# EAGLE board DATALOGGER_CA_ADC_V1 (EAGLE 9.5.2)
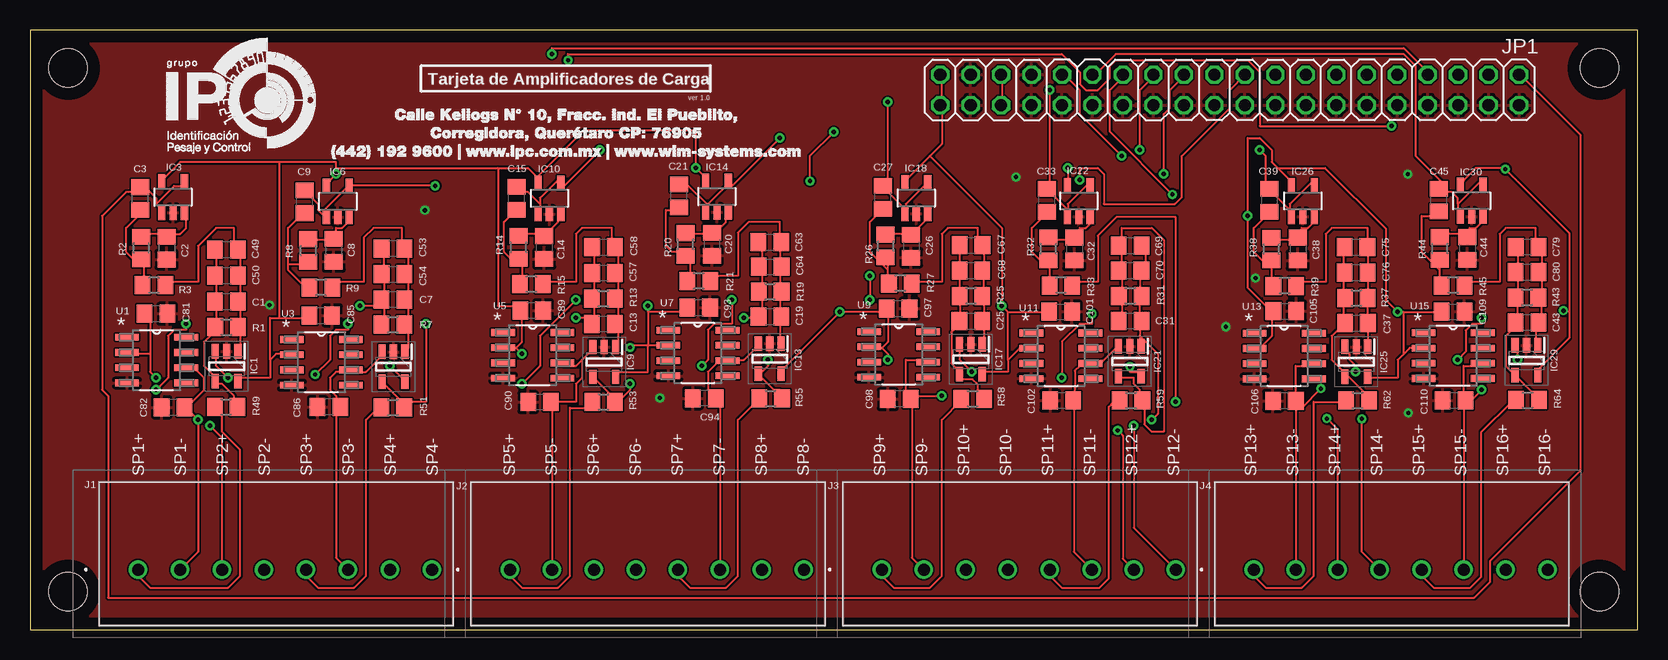
[diagram p11: board, top side]
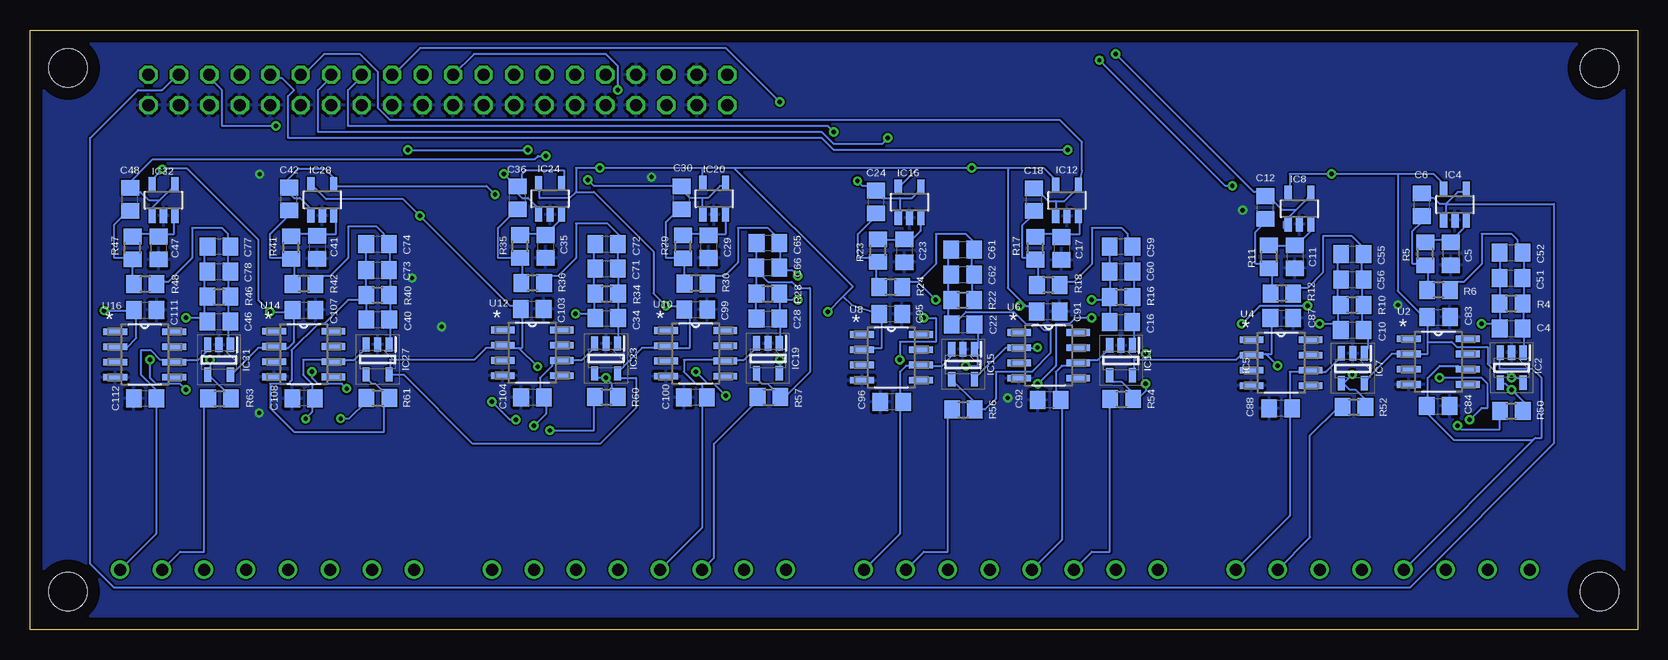
[diagram p12: board, bottom side, seen from below]

Size 134 x 50 mm. Coordinates in mm from the lower left corner, seen from the top.
Outline: 0,0 134,0 134,50 0,50 0,0
Copper layers (1*16): Top 0.035mm / dielectric 1.5mm / Bottom 0.035mm
Design rules "default": minimum track width 6mil, minimum drill 0.35mm, track to track 6mil, track to pad 6mil, pad to pad 6mil, via to via 6mil, smd to smd 6mil, copper to edge 40mil, drill to drill 6mil, minimum pad ring 10mil, minimum via ring 8mil, stop-mask expansion 4mil, vias tented up to drill 0mil, thermal gap 10mil
Holes 3.2 mm at 3.18,3.18 3.18,46.82 130.82,3.18 130.82,46.82

## Footprints (pad centres in the part's own frame; a part is rotated, then mirrored left to right if it is on the bottom)
C0805 = smd 1.3 x 1.5: 1 -0.95,0; 2 0.95,0
SOT95P280X145-5N = smd 1.2 x 0.6: 1 -1.25,0.95; 2 -1.25,0; 3 -1.25,-0.95; 4 1.25,-0.95; 5 1.25,0.95
SOT23-5 = smd 0.6 x 1.2: 1 -0.95,-1.306; 2 0,-1.306; 3 0.95,-1.306; 4 0.95,1.306; 5 -0.95,1.306
1985027 = drill 1 pad 1.5: 1 0,0; 2 3.5,0; 3 7,0; 4 10.5,0; 5 14,0; 6 17.5,0; 7 21,0; 8 24.5,0
2X20 = drill 1.016 octagon: 1 -24.13,-1.27; 2 -24.13,1.27; 3 -21.59,-1.27; 4 -21.59,1.27; 5 -19.05,-1.27; 6 -19.05,1.27; 7 -16.51,-1.27; 8 -16.51,1.27; 9 -13.97,-1.27; 10 -13.97,1.27; 11 -11.43,-1.27; 12 -11.43,1.27; 13 -8.89,-1.27; 14 -8.89,1.27; 15 -6.35,-1.27; 16 -6.35,1.27; 17 -3.81,-1.27; 18 -3.81,1.27; 19 -1.27,-1.27; 20 -1.27,1.27; 21 1.27,-1.27; 22 1.27,1.27; 23 3.81,-1.27; 24 3.81,1.27; 25 6.35,-1.27; 26 6.35,1.27; 27 8.89,-1.27; 28 8.89,1.27; 29 11.43,-1.27; 30 11.43,1.27; 31 13.97,-1.27; 32 13.97,1.27; 33 16.51,-1.27; 34 16.51,1.27; 35 19.05,-1.27; 36 19.05,1.27; 37 21.59,-1.27; 38 21.59,1.27; 39 24.13,-1.27; 40 24.13,1.27
R0805 = smd 1.3 x 1.5: 1 -0.95,0; 2 0.95,0
D8 = smd 1.981 x 0.559: 1 -2.464,1.905; 2 -2.464,0.635; 3 -2.464,-0.635; 4 -2.464,-1.905; 5 2.464,-1.905; 6 2.464,-0.635; 7 2.464,0.635; 8 2.464,1.905

## Placement (x,y rotation side)
C1  150nF  [C0805]  16.38,27.37 0 top
C2  0.018uF  [C0805]  11.39,31.8 270 top
C3  39uF  [C0805]  9.2,35.95 90 top
C4  150nF  [C0805]  10.53,25.09 0 bottom
C5  0.018uF  [C0805]  15.56,31.34 270 bottom
C6  39uF  [C0805]  17.96,35.43 90 bottom
C7  150nF  [C0805]  30.25,27.54 0 top
C8  0.018uF  [C0805]  25.32,31.62 270 top
C9  39uF  [C0805]  22.88,35.68 90 top
C10  150nF  [C0805]  23.78,24.98 0 bottom
C11  0.018uF  [C0805]  28.58,31.09 270 bottom
C12  39uF  [C0805]  31.02,35.2 90 bottom
C13  150nF  [C0805]  47.78,25.5 0 top
C14  0.018uF  [C0805]  42.86,31.87 270 top
C15  39uF  [C0805]  40.56,35.97 90 top
C16  150nF  [C0805]  43.07,25.63 0 bottom
C17  0.018uF  [C0805]  48.01,31.78 270 bottom
C18  39uF  [C0805]  50.3,35.85 90 bottom
C19  150nF  [C0805]  61.68,26.11 0 top
C20  0.018uF  [C0805]  56.84,32.13 270 top
C21  39uF  [C0805]  54.1,36.17 90 top
C22  150nF  [C0805]  56.22,25.43 0 bottom
C23  0.018uF  [C0805]  61.12,31.59 270 bottom
C24  39uF  [C0805]  63.46,35.65 90 bottom
C25  150nF  [C0805]  78.43,25.74 0 top
C26  0.018uF  [C0805]  73.46,31.96 270 top
C27  39uF  [C0805]  71.12,36.04 90 top
C28  150nF  [C0805]  72.48,25.92 0 bottom
C29  0.018uF  [C0805]  77.43,31.93 270 bottom
C30  39uF  [C0805]  79.68,36 90 bottom
C31  150nF  [C0805]  91.71,25.75 0 top
C32  0.018uF  [C0805]  87.05,31.74 270 top
C33  39uF  [C0805]  84.77,35.79 90 top
C34  150nF  [C0805]  85.93,25.96 0 bottom
C35  0.018uF  [C0805]  91.02,31.95 270 bottom
C36  39uF  [C0805]  93.36,36 90 bottom
C37  150nF  [C0805]  110.57,25.55 0 top
C38  0.018uF  [C0805]  105.68,31.74 270 top
C39  39uF  [C0805]  103.33,35.8 90 top
C40  150nF  [C0805]  105.01,25.85 0 bottom
C41  0.018uF  [C0805]  110.05,31.87 270 bottom
C42  39uF  [C0805]  112.39,35.9 90 bottom
C43  150nF  [C0805]  124.79,25.62 0 top
C44  0.018uF  [C0805]  119.8,31.78 270 top
C45  39uF  [C0805]  117.43,35.81 90 top
C46  150nF  [C0805]  118.26,25.68 0 bottom
C47  0.018uF  [C0805]  123.29,31.82 270 bottom
C48  39uF  [C0805]  125.66,35.88 90 bottom
C49  18nF  [C0805]  16.38,31.69 0 top
C50  12nF  [C0805]  16.37,29.51 0 top
C51  18nF  [C0805]  10.55,29.32 0 bottom
C52  12nF  [C0805]  10.54,31.43 0 bottom
C53  18nF  [C0805]  30.26,31.79 0 top
C54  12nF  [C0805]  30.26,29.63 0 top
C55  18nF  [C0805]  23.77,31.31 0 bottom
C56  12nF  [C0805]  23.77,29.2 0 bottom
C57  18nF  [C0805]  47.8,29.74 0 top
C58  12nF  [C0805]  47.8,31.89 0 top
C59  18nF  [C0805]  43.05,31.95 0 bottom
C60  12nF  [C0805]  43.05,29.84 0 bottom
C61  18nF  [C0805]  56.25,31.7 0 bottom
C62  12nF  [C0805]  56.25,29.59 0 bottom
C63  18nF  [C0805]  61.67,32.31 0 top
C64  12nF  [C0805]  61.7,30.25 0 top
C65  18nF  [C0805]  72.49,32.25 0 bottom
C66  12nF  [C0805]  72.5,30.19 0 bottom
C67  18nF  [C0805]  78.45,32.04 0 top
C68  12nF  [C0805]  78.44,29.93 0 top
C69  18nF  [C0805]  91.71,32.02 0 top
C70  12nF  [C0805]  91.69,29.93 0 top
C71  18nF  [C0805]  85.94,30.1 0 bottom
C72  12nF  [C0805]  85.94,32.16 0 bottom
C73  18nF  [C0805]  105.03,29.97 0 bottom
C74  12nF  [C0805]  105.03,32.14 0 bottom
C75  18nF  [C0805]  110.53,31.9 0 top
C76  12nF  [C0805]  110.54,29.77 0 top
C77  18nF  [C0805]  118.24,31.95 0 bottom
C78  12nF  [C0805]  118.25,29.84 0 bottom
C79  18nF  [C0805]  124.8,31.92 0 top
C80  12nF  [C0805]  124.79,29.81 0 top
C81  1uF  [C0805]  10.5,26.35 0 top
C82  1uF  [C0805]  11.93,18.53 180 top
C83  1uF  [C0805]  16.59,26.05 0 bottom
C84  1uF  [C0805]  16.61,18.63 0 bottom
C85  1uF  [C0805]  24.23,26.2 0 top
C86  1uF  [C0805]  24.92,18.55 180 top
C87  1uF  [C0805]  29.65,25.97 0 bottom
C88  1uF  [C0805]  29.74,18.44 180 bottom
C89  1uF  [C0805]  41.82,26.62 0 top
C90  1uF  [C0805]  42.48,18.96 180 top
C91  1uF  [C0805]  49.12,26.53 0 bottom
C92  1uF  [C0805]  49.03,19.14 180 bottom
C93  1uF  [C0805]  55.74,26.85 0 top
C94  1uF  [C0805]  56.21,19.29 180 top
C95  1uF  [C0805]  62.26,26.33 0 bottom
C96  1uF  [C0805]  62.17,18.99 180 bottom
C97  1uF  [C0805]  72.36,26.76 0 top
C98  1uF  [C0805]  72.45,19.22 180 top
C99  1uF  [C0805]  78.5,26.68 0 bottom
C100  1uF  [C0805]  78.55,19.34 180 bottom
C101  1uF  [C0805]  85.92,26.5 0 top
C102  1uF  [C0805]  85.99,19.09 180 top
C103  1uF  [C0805]  92.14,26.72 0 bottom
C104  1uF  [C0805]  92.11,19.37 180 bottom
C105  1uF  [C0805]  104.6,26.54 0 top
C106  1uF  [C0805]  104.57,19.08 180 top
C107  1uF  [C0805]  111.15,26.64 0 bottom
C108  1uF  [C0805]  111.19,19.29 180 bottom
C109  1uF  [C0805]  118.63,26.5 0 top
C110  1uF  [C0805]  118.71,19.09 180 top
C111  1uF  [C0805]  124.4,26.63 0 bottom
C112  1uF  [C0805]  124.4,19.25 180 bottom
IC1  TLV2771CDBVR  [SOT95P280X145-5N]  16.39,21.96 270 top
IC2  TLV2771CDBVR  [SOT95P280X145-5N]  10.49,21.84 270 bottom
IC3  MCP601OT  [SOT23-5]  11.93,36.06 0 top
IC4  MCP601OT  [SOT23-5]  15.21,35.44 0 bottom
IC5  TLV2771CDBVR  [SOT95P280X145-5N]  30.3,21.92 270 top
IC6  MCP601OT  [SOT23-5]  25.66,35.71 0 top
IC7  TLV2771CDBVR  [SOT95P280X145-5N]  23.73,21.78 270 bottom
IC8  MCP601OT  [SOT23-5]  28.18,35.1 0 bottom
IC9  TLV2771CDBVR  [SOT95P280X145-5N]  47.86,22.31 270 top
IC10  MCP601OT  [SOT23-5]  43.3,35.96 0 top
IC11  TLV2771CDBVR  [SOT95P280X145-5N]  43.06,22.45 270 bottom
IC12  MCP601OT  [SOT23-5]  47.56,35.78 0 bottom
IC13  TLV2771CDBVR  [SOT95P280X145-5N]  61.67,22.59 270 top
IC14  MCP601OT  [SOT23-5]  57.27,36.11 0 top
IC15  TLV2771CDBVR  [SOT95P280X145-5N]  56.22,22.11 270 bottom
IC16  MCP601OT  [SOT23-5]  60.68,35.63 0 bottom
IC17  TLV2771CDBVR  [SOT95P280X145-5N]  78.43,22.54 270 top
IC18  MCP601OT  [SOT23-5]  73.88,35.98 0 top
IC19  TLV2771CDBVR  [SOT95P280X145-5N]  72.49,22.61 270 bottom
IC20  MCP601OT  [SOT23-5]  76.97,35.93 0 bottom
IC21  TLV2771CDBVR  [SOT95P280X145-5N]  91.68,22.36 270 top
IC22  MCP601OT  [SOT23-5]  87.43,35.74 0 top
IC23  TLV2771CDBVR  [SOT95P280X145-5N]  85.98,22.61 270 bottom
IC24  MCP601OT  [SOT23-5]  90.65,35.93 0 bottom
IC25  TLV2771CDBVR  [SOT95P280X145-5N]  110.55,22.33 270 top
IC26  MCP601OT  [SOT23-5]  106.1,35.74 0 top
IC27  TLV2771CDBVR  [SOT95P280X145-5N]  105.02,22.52 270 bottom
IC28  MCP601OT  [SOT23-5]  109.63,35.83 0 bottom
IC29  TLV2771CDBVR  [SOT95P280X145-5N]  124.75,22.44 270 top
IC30  MCP601OT  [SOT23-5]  120.18,35.76 0 top
IC31  TLV2771CDBVR  [SOT95P280X145-5N]  118.25,22.48 270 bottom
IC32  MCP601OT  [SOT23-5]  122.87,35.81 0 bottom
J1  1985027  [1985027]  9,5 0 top
J2  1985027  [1985027]  40,5 0 top
J3  1985027  [1985027]  71,5 0 top
J4  1985027  [1985027]  102,5 0 top
JP1  [2X20]  100,45 180 top
R1  10M  [R0805]  16.39,25.22 0 top
R2  13.3K  [R0805]  9.29,31.82 90 top
R3  7.5K  [R0805]  10.33,28.71 180 top
R4  10M  [R0805]  10.54,27.2 0 bottom
R5  13.3K  [R0805]  17.69,31.34 90 bottom
R6  7.5K  [R0805]  16.59,28.3 180 bottom
R7  10M  [R0805]  30.25,25.45 0 top
R8  13.3K  [R0805]  23.2,31.61 90 top
R9  7.5K  [R0805]  24.24,28.52 180 top
R10  10M  [R0805]  23.78,27.08 0 bottom
R11  13.3K  [R0805]  30.72,31.09 90 bottom
R12  7.5K  [R0805]  29.65,28.04 180 bottom
R13  10M  [R0805]  47.79,27.6 0 top
R14  13.3K  [R0805]  40.73,31.88 90 top
R15  7.5K  [R0805]  41.79,28.8 180 top
R16  10M  [R0805]  43.06,27.72 0 bottom
R17  13.3K  [R0805]  50.19,31.8 90 bottom
R18  7.5K  [R0805]  49.12,28.72 180 bottom
R19  10M  [R0805]  61.69,28.19 0 top
R20  13.3K  [R0805]  54.66,32.12 90 top
R21  7.5K  [R0805]  55.75,29.06 180 top
R22  10M  [R0805]  56.24,27.48 0 bottom
R23  13.3K  [R0805]  63.32,31.6 90 bottom
R24  7.5K  [R0805]  62.25,28.55 180 bottom
R25  10M  [R0805]  78.44,27.83 0 top
R26  13.3K  [R0805]  71.33,31.98 90 top
R27  7.5K  [R0805]  72.56,28.87 180 top
R28  10M  [R0805]  72.49,28 0 bottom
R29  13.3K  [R0805]  79.57,31.92 90 bottom
R30  7.5K  [R0805]  78.49,28.87 180 bottom
R31  10M  [R0805]  91.72,27.83 0 top
R32  13.3K  [R0805]  84.89,31.75 90 top
R33  7.5K  [R0805]  85.94,28.71 180 top
R34  10M  [R0805]  85.93,28.01 0 bottom
R35  13.3K  [R0805]  93.14,31.95 90 bottom
R36  7.5K  [R0805]  92.1,28.9 180 bottom
R37  10M  [R0805]  110.56,27.64 0 top
R38  13.3K  [R0805]  103.47,31.73 90 top
R39  7.5K  [R0805]  104.59,28.66 180 top
R40  10M  [R0805]  105.02,27.9 0 bottom
R41  13.3K  [R0805]  112.23,31.85 90 bottom
R42  7.5K  [R0805]  111.15,28.82 180 bottom
R43  10M  [R0805]  124.78,27.7 0 top
R44  13.3K  [R0805]  117.53,31.78 90 top
R45  7.5K  [R0805]  118.63,28.7 180 top
R46  10M  [R0805]  118.26,27.75 0 bottom
R47  13.3K  [R0805]  125.45,31.82 90 bottom
R48  7.5K  [R0805]  124.39,28.79 180 bottom
R49  1K  [R0805]  16.36,18.55 0 top
R50  1K  [R0805]  10.52,18.24 0 bottom
R51  1K  [R0805]  30.24,18.52 0 top
R52  1K  [R0805]  23.63,18.57 0 bottom
R53  1K  [R0805]  47.82,18.99 0 top
R54  1K  [R0805]  43,19.22 0 bottom
R55  1K  [R0805]  61.73,19.28 0 top
R56  1K  [R0805]  56.18,18.34 0 bottom
R57  1K  [R0805]  72.4,19.38 0 bottom
R58  1K  [R0805]  78.59,19.24 0 top
R59  1K  [R0805]  91.78,19.11 0 top
R60  1K  [R0805]  85.95,19.39 0 bottom
R61  1K  [R0805]  105,19.3 0 bottom
R62  1K  [R0805]  110.67,19.1 0 top
R63  1K  [R0805]  118.2,19.28 0 bottom
R64  1K  [R0805]  124.83,19.13 0 top
U1  REF5025AID  [D8]  10.55,22.47 0 top
U2  REF5025AID  [D8]  16.6,22.34 0 bottom
U3  REF5025AID  [D8]  24.3,22.29 0 top
U4  REF5025AID  [D8]  29.71,22.25 0 bottom
U5  REF5025AID  [D8]  41.91,22.87 0 top
U6  REF5025AID  [D8]  49.09,22.86 0 bottom
U7  REF5025AID  [D8]  55.68,23.06 0 top
U8  REF5025AID  [D8]  62.19,22.69 0 bottom
U9  REF5025AID  [D8]  72.42,22.94 0 top
U10  REF5025AID  [D8]  78.51,23.03 0 bottom
U11  REF5025AID  [D8]  85.94,22.82 0 top
U12  REF5025AID  [D8]  92.13,23.08 0 bottom
U13  REF5025AID  [D8]  104.55,22.81 0 top
U14  REF5025AID  [D8]  111.18,22.96 0 bottom
U15  REF5025AID  [D8]  118.63,22.83 0 top
U16  REF5025AID  [D8]  124.43,22.94 0 bottom

## Tracks (layer width: path | path; a pad name or v marks a point on that pad's centre or on a via)
+5V  (via drill 0.35)
  Top 0.152: 114.5,23 115,23.5 116,23.5 U15.2 | 114.5,23 114,22.5 114,21 111.5,21 IC25.5 | 114.5,26.5 117.67,26.5 C109.1 | 114.5,23 114.5,26.5 | 114.5,26.5 v114,26.5 113,27.5 113,33.46 107.96,38.5 104,38.5 | IC30.5 119.5,37.5 120.5,38.5 122.97,38.5 v122.97,38.39 128.31,33.06 128.31,26.52 | 128.31,26.52 128.31,24.31 125.5,21.5 IC29.5 | 128.31,26.52 127.89,26.52 v127.83,26.59 | 104,38.5 103.5,39 103.5,40 102.5,41 101.5,41 v101.5,34.5 101.5,28.5 103.5,26.5 | 104,38.5 105,37.5 IC26.5 | 103.5,26.5 103.5,24.5 102.5,23.5 U13.2 | 103.5,26.5 C105.1 | v91.68,21.92 91.68,21.5 92.5,21.5 IC21.5 | v10.5,21 10,21.5 10,23 | 10,23 10,26 C81.1 | 10,23 8.5,23 U1.2 | v30,22 30.9,21.1 IC5.5 | 20,22.5 20,21 17.5,21 IC1.5 | 20,22.5 20.5,23 21.5,23 U3.2 | 20.77,26 20,26 20,22.5 | 20.77,26 23,26 C85.1 | 40.5,23.5 41,24 41,26.5 C89.1 40.5,27 39,27 39,38.5 | 40.5,23.5 39.5,23.5 U5.2 | IC6.5 25,37.5 v25.5,38 25.5,38.5 | 42.25,37.75 41.5,38.5 39,38.5 | 42.25,37.75 42.5,37.5 IC10.5 | 25.5,38.5 39,38.5 | 20.77,39 25.5,39 25.5,38.5 | 20.77,39 12.5,39 11,37.5 IC3.5 | 20.77,39 20.77,26 | 40.5,23.5 v41,23 | 81.5,22.5 81.5,21.5 79.5,21.5 IC17.5 | 81.5,22.5 82.5,23.5 83,23.5 U11.2 | 81.5,26.5 84.92,26.5 C101.1 | 81.5,22.5 81.5,26.5 | 75,39.5 76,40.5 76,43.5 JP1.40 76,44 76,46 JP1.39 | 75,39.5 73,37.5 IC18.5 | 81.5,26.5 v81,27 81,33.5 75,39.5 | v71.5,22.5 71.5,23 71,23.5 | 71,23.5 70,23.5 U9.2 | IC13.5 62.5,21.5 v67.5,26.5 71,26.5 C97.1 71.5,26.5 71.5,24 71,23.5 | IC9.5 49,21.5 51.5,21.5 51.5,23.69 51.51,23.7 | 51.5,26.5 54.54,26.5 C93.1 | v86.5,38.5 86.5,37.5 IC22.5 | IC14.5 56.5,37.5 v55.5,38.5 55.5,41.62 46.13,41.62 42.25,37.75 | v51.5,27 51.5,26.5 | U7.2 51.51,23.7
  Top 0.152: 51.51,23.7 50.2,23.7 v50.02,23.52 | 51.5,26.5 51.5,23.71 51.51,23.7
  Bottom 0.152: IC31.5 117,21.5 115,23.5 114,23.5 U14.2 113.5,23.5 112.5,23.5 112,24 112,26.42 C107.1 112.41,26.5 v114,26.5 114.98,27.48 114.98,32.52 120.92,38.46 123.03,38.46 123.03,38.44 v122.97,38.39 123.87,37.5 124,37.5 IC32.5 | U16.2 126.5,23.5 125.96,23.5 125.13,24.33 125.13,26.55 C111.1 125.4,26.59 v127.83,26.59 | 93.25,23.5 v91.68,21.92 | 93.25,23.5 94.5,23.5 U12.2 95,23.5 96,23.5 97,22.5 104,22.5 104,21.5 IC27.5 102.87,21.27 97.1,15.5 86.5,15.5 83.5,18.5 83.5,21 85,21 IC23.5 85,21.5 83,23.5 81,23.5 U10.2 80.5,23.5 79,23.5 79,26.43 C99.1 79.53,27 v81,27 82.04,28.04 82.04,31.54 87,36.5 88.5,36.5 | 93.25,23.5 93,23.5 93,26.27 C103.1 93.61,27 94,27 v101.5,34.5 102.89,35.89 109.31,35.89 110.56,37.14 IC28.5 | IC2.5 9.5,21 v10.5,21 10.93,21.43 11.77,21.43 12.5,22.16 12.5,23.55 15.05,23.55 15.5,24 17.5,24 | IC7.5 22.5,21 20.5,23 19.5,23 U2.2 19,23 17.5,23 17.5,24 | 17.5,24 17.5,25.96 C83.1 17.81,26.05 20,28.23 20,38 | 31,23 v30,22 | 31,23 32,23 U4.2 32.5,23 33,23 33.5,22.5 41,22.5 | 41,22.5 42,22.5 42,21.5 IC11.5 | 31,23 30.5,23 30.5,25.5 C87.1 | 20,38 17,38 16,37 IC4.5 | 20,38 v25.5,38 29,38 29,36.5 IC8.5 | v41,23 41,22.5 | v71.5,22.5 71.5,21.5 IC19.5 | IC15.5 55.26,20.92 52.68,23.5 52,23.5 U6.2 50.06,23.5 v50.02,23.52 | U8.2 64.5,23.5 63,23.5 63,25.9 C95.1 65.5,27.05 66.22,27.78 | 60,38.5 61.5,37 IC16.5 | 52.5,38.5 49.5,38.5 48.5,37.5 IC12.5 | 52.5,38.5 v55.5,38.5 60,38.5 | 78,38.5 78,37.5 IC20.5 | 60,38.5 75.31,38.5 | 75.31,38.5 78,38.5 | 78,38.5 v86.5,38.5 88.5,38.5 88.5,36.5 | 88.5,36.5 89.03,35.98 91.51,35.98 91.51,37.03 IC24.5 | 51,27 50.54,27 C91.1 | 51,27 52.5,28.5 52.5,38.5
  Bottom 0.152: 75.31,38.5 65.41,28.59 66.22,27.78 | 51,27 v51.5,27 | 66.22,27.78 v67.5,26.5
+12V
  Top 0.152: JP1.36 81,44 81,46 JP1.35
GND  (via drill 0.35)
  other vias: 19.96,27.05 99.68,25.25 32.92,34.96 52.5,19.32 114.88,18.07 114.86,37.99 82.19,37.74 102.16,29.31
  pour Top: 0,50 0,0 134,0 134,50
  pour Bottom: 0,50 0,0 134,0 134,50
INPUT1+
  Top 0.152: 10.5,35.5 11,35 IC3.1 | 10.5,35.5 10.5,36 9.5,37 C3.2 9,36.5 8,36.5 6,34.5 6,20 6.5,19.5 6.5,2.66 120.38,2.66 121.72,3.99 121.72,5.72 129.26,13.26 129.26,41.24 124.5,46 JP1.1 | 10.5,35.5 12,37 13,37 IC3.4
INPUT2+
  Bottom 0.152: 16,35.5 16,34.5 IC4.1 | 16,35.5 15,36.5 14.5,36.5 IC4.4 | 16,35.5 16.5,35.5 17,36 17.5,36 C6.2 | 16,35.5 6.97,35.5 6.97,15.53 19,3.5 127,3.5 129,5.5 129,41 125,45 123,45 122,46 JP1.3
INPUT3+  (via drill 0.35)
  Top 0.152: 24.5,34.5 24,35 24,35.5 23,36.5 C9.2 | 26.5,37 24.5,35 24.5,34.5 | 26.5,37 26.52,37.02 33.75,37.02 v33.78,37 | 24.5,34.5 IC6.1 | v113.5,42 102.5,42 102.5,46.5 101.5,47.5 90.5,47.5 90,47 90,46 89,45 88,45 87.5,45.5 87.5,46.5 86,48 44.84,48 v44.84,47.49 | 26.5,37 IC6.4
  Bottom 0.152: v113.5,42 118,42 118,45 119,46 JP1.5 | v44.84,47.49 34.36,37 v33.78,37
INPUT4+  (via drill 0.35)
  Top 0.152: v43.5,48 43.5,48.5 114.5,48.5 116.5,46.5 JP1.7
  Bottom 0.152: 28.5,35 29.5,34 29.5,33.5 29,33.5 IC8.1 | 28.5,35 27.5,36 IC8.4 | 28.5,35 29.59,35 30.63,36.04 C12.2 31.12,36.5 32,36.5 v43.5,48
INPUT5+  (via drill 0.35)
  Top 0.152: 42.5,35.5 42.5,36 44,37.5 IC10.4 44.5,37 v47.5,40 | 42.5,35.5 42.5,35 IC10.1 | 42.5,35.5 41.5,36.5 41,36.5 C15.2
  Bottom 0.152: v47.5,40 67,40 68,41 112.5,41 112.5,44.5 112,45 113,46 113.5,46 JP1.9
INPUT6+
  Bottom 0.152: 48.5,35.73 48.5,34.5 IC12.1 | 48.5,35.73 49.1,35.73 49.87,36.5 50,36.5 C18.2 | 48.5,35.73 47.77,35.73 46.5,37 IC12.4 46.3,38.29 46.3,40.65 48.15,42.5 104,42.5 105,43.5 105,46.5 106.5,48 109.5,48 111,46.5 JP1.11
INPUT7+  (via drill 0.35)
  Top 0.152: 56.5,35.39 54.78,37.12 C21.2 | 56.5,35.39 56.5,35 IC14.1 | 56.5,35.39 56.5,35.5 58,37 IC14.4 58.5,37 v62.5,41
  Bottom 0.152: v62.5,41 63,40.5 67,40.5 68,41.5 110,41.5 110,45 109,46 JP1.13
INPUT8+  (via drill 0.35)
  Top 0.152: v67,41.5 65.01,39.51 v65.01,37.41
  Bottom 0.152: 61.5,36 61.5,34.5 IC16.1 | 61.5,36 63,36 63.5,36.5 C24.2 63.5,37 64.6,37 v65.01,37.41 | 61.5,36 60.5,36 60,36.5 IC16.4 | v67,41.5 67.5,42 107.5,42 107.5,45 106.5,46 JP1.15
INPUT9+  (via drill 0.35)
  Top 0.152: 73,35 73,35.5 75,37.5 IC18.4 | 73,35 71.5,36.5 C27.2 71.5,37 v71.5,44 | 73,35 IC18.1
  Bottom 0.152: v71.5,44 76,48.5 101.5,48.5 103.5,46.5 JP1.17
INPUT10+  (via drill 0.35)
  Top 0.152: JP1.19 100,45 100,43.5 96,39.5 96,36.07 95.43,35.5 89.5,35.5 89.5,38 89,38.5 87.5,38.5 v87.5,37.5
  Bottom 0.152: 78,36 78,35 IC20.1 | 78,36 77.5,36 76.5,37 76,37 IC20.4 | 78,36 79,36 79.5,36.5 C30.2 80,37 87,37 v87.5,37.5
INPUT11+  (via drill 0.35)
  Top 0.152: 86.5,35 86.5,35.5 88.5,37.5 IC22.4 | 86.5,35 86.5,34.5 IC22.1 86.5,35 | 86.5,35 85,36.5 C33.2 85,37 v85,45
  Bottom 0.152: JP1.21 97,48 86,48 85,47 v85,45
INPUT12+  (via drill 0.35)
  Top 0.152: v94.5,38 94.5,43 95,43.5 95,45 96,46 JP1.23
  Bottom 0.152: IC24.4 89.5,37.5 89.5,38.31 92.69,38.31 93,38 93,37 C36.2 | IC24.1 91.5,35 92.5,36 93,36 93.5,36.5 C36.2 | v94.5,38 93.5,37 C36.2
INPUT13+  (via drill 0.35)
  Top 0.152: 105,35 105,35.5 107,37.5 IC26.4 | 105,35 105,34.5 IC26.1 105,35 | 105,35 103.5,36.5 C39.2 103,37 103,39.5 v102.5,40 | v92.5,40 92.5,45 93.5,46 JP1.25
  Bottom 0.152: v102.5,40 v92.5,40
INPUT14+  (via drill 0.35)
  Top 0.152: v95.24,36.28 90,41.52 90,45 91,46 JP1.27
  Bottom 0.152: IC28.1 110.5,35 111.5,36 112,36 112.5,36.5 C42.2 112.72,37.31 111.59,38.44 109.44,38.44 108.5,37.5 IC28.4 108.5,37 95.96,37 v95.24,36.28
INPUT15+
  Top 0.152: 119,35.5 119,34.5 IC30.1 | 119,35.5 121,37.5 IC30.4 | 118,36.5 118.5,36.5 119,36 119,35.5 | 118,36.5 117.5,36.5 C45.2 118,36.5 | 118,36.5 118,37 115.5,39.5 115.5,47 114.5,48 90.5,48 89,46.5 JP1.29
INPUT16+  (via drill 0.35)
  Top 0.152: v91,39.5 87.5,43 87.5,45 86.5,46 JP1.31
  Bottom 0.152: 123.22,35.77 123.84,35.16 123.84,35 124,35 IC32.1 | 123.22,35.77 122,37 IC32.4 | 123.22,35.77 124.07,35.77 124.8,36.5 125.5,36.5 C48.2 126,37 123.77,39.23 91.93,39.23 91.66,39.5 v91,39.5
N$1
  Top 0.152: IC5.1 31.5,23.48 31.5,25.3 R7.2 31.5,25.82 31.5,27.29 C7.2 31.5,27.82 31.5,29.31 C54.2 31.5,29.79 31.5,31.78 C53.2 31,32.35 31,33.49 28.64,33.49 27.82,32.67 27.82,29 25.5,29 R9.1
N$2
  Top 0.152: IC1.1 17.5,23.5 17.5,25 R1.2 17.5,25.5 17.5,27 C1.2 17.5,27.5 17.5,29.5 C50.2 17.5,30 17.5,31.5 C49.2 17,32 17,33.5 15.5,33.5 14,32 14,29 11.5,29 R3.1
N$3
  Top 0.152: IC3.3 13,34.5 13,33.5 12.5,33 11.5,33 C2.1 11,33 9.5,33 R2.2
N$4
  Top 0.152: R3.2 9.5,29 9.5,30.5 R2.1 9,30.5 8,31.5 8,33.5 9,34.5 C3.1
N$5
  Top 0.152: IC6.3 26.5,34 26,33.5 25.5,33.5 25.5,33 C8.1 25,32.5 23.5,32.5 R8.2
N$6
  Bottom 0.152: IC2.1 9.5,23.5 9.5,25 C4.2 9.5,25.5 9.5,27 R4.2 9.5,27.5 9.5,29 C51.2 9.5,29.5 9.5,31 C52.2 10,31.5 10,32.5 10.5,33 13,33 13,30.5 14.5,29 15,29 15.55,28.45 R6.1
N$7
  Bottom 0.152: IC4.3 14.5,34 14.5,33.5 15.5,32.5 C5.1 16,32.5 17.5,32.5 R5.2
N$8
  Bottom 0.152: R6.2 17.5,28.47 17.5,30 R5.1 18,30.5 18.75,30.5 18.75,33.25 18,34 C6.1
N$9
  Top 0.152: 21.5,30.5 21.5,30 23,28.5 R9.2 | 21.5,30.5 21.5,33.5 22.5,34.5 C9.1 | 21.5,30.5 23,30.5 R8.1
N$10
  Bottom 0.152: IC7.1 22.5,23.5 22.5,24.5 C10.2 23,25 23,27 R10.2 23,27.5 23,29 C56.2 23,29.5 23,31 C55.2 22.5,31.5 23.8,32.8 26.22,32.8 26.22,29.78 27.5,28.5 28.5,28.5 R12.1
N$11
  Bottom 0.152: IC8.3 27.33,33.69 27.33,33.15 28.44,32.04 C11.1 29,32 30.5,32 R11.2
N$12
  Bottom 0.152: R12.2 30.5,28.5 30.5,30 R11.1 31,30.5 31.84,30.5 31.84,33.16 31.29,33.71 C12.1
N$13
  Top 0.152: IC9.1 49,24 49,25 C13.2 49,25.5 49,27.5 R13.2 49,28 49,29.5 C57.2 49,30 49,31.5 C58.2 48.5,32 48.5,33.5 46,33.5 45.5,33 45.5,29 43,29 R15.1
N$14
  Top 0.152: IC10.3 44,34.5 44,34 43,33 C14.1 42.5,33 41,33 R14.2
N$15
  Top 0.152: C15.1 40.5,35 39.5,34 39.5,31.5 40.5,30.5 R14.1 41,30.5 41,29 R15.2
N$16
  Bottom 0.152: IC11.1 42,24 42,25.5 C16.2 42,26 42,27.5 R16.2 42,28 42,29.5 C60.2 42,30 42,31.5 C59.2 42.5,32 42.5,33 43,33.5 45.5,33.5 45.5,30.5 47,29 48.02,29 R18.1
N$17
  Bottom 0.152: IC12.3 46.5,34 46.5,33 48,33 C17.1 48.46,33 50.02,33 R17.2
N$18
  Bottom 0.152: R18.2 50,29.04 50,30.56 R17.1 50.43,31 51.26,31 51.26,33.74 50.5,34.5 C18.1
N$19
  Top 0.152: IC13.1 62.5,24 62.5,25.75 C19.2 62.5,26.37 62.5,27.74 R19.2 62.5,28.35 62.5,30.24 C64.2 62.5,30.84 62.5,32.16 C63.2 62.5,32.66 62.5,34 59.92,34 59,33.08 59,29.5 57,29.5 R21.1
N$20
  Top 0.152: IC14.3 58,34.5 58,34 57,33 C20.1 56.5,33 55,33 R20.2
N$21
  Top 0.152: C21.1 54.09,35 53,35 53,32 53.5,31.5 54.5,31.5 R20.1 55,31 55,29.5 R21.2
N$22  (via drill 0.35)
  Top 0.152: v56,22 56.5,22.5 56.5,25 57,25.5 58.5,25.5 v58.5,27.5
  Bottom 0.152: C22.2 55,25.02 55,23.42 IC15.1 55,22.92 55,22 v56,22 | R22.2 55.5,27.5 55.5,29.5 C62.2 55.5,30 55.5,31.5 C61.2 55,32 56,33 58.5,33 58.5,30.5 60,29 | 60,29 61.03,29 R24.1 | 60,29 v58.5,27.5
N$23
  Bottom 0.152: IC16.3 59.78,34.27 59.78,33.25 60.49,32.54 C23.1 61.5,32.5 63,32.5 R23.2
N$24
  Bottom 0.152: R24.2 63.5,29.05 63.5,30.5 R23.1 63.5,31 65,31 65,33 63.5,34.5 C24.1
N$25
  Top 0.152: IC17.1 79.5,24 79.5,25.5 C25.2 79.5,26 79.5,27.5 R25.2 79.5,28 79.5,29.5 C68.2 79.5,30 79.5,32 C67.2 79,32.5 79,33.5 76.5,33.5 76,33 76,29 73.68,29 R27.1
N$26
  Top 0.152: IC18.3 75,34.5 73.5,33 C26.1 73,33 71.45,33 R26.2
N$27
  Top 0.152: 71.5,30 71.5,29.06 R27.2 | 71.5,30 71.5,31.02 R26.1 | 71.5,30 70,31.5 70,34 71,35 C27.1
N$28  (via drill 0.35)
  Top 0.152: v70,29.5 v70,27.5
  Bottom 0.152: IC19.1 71.5,24 71.5,25.75 C28.2 71.5,26.04 71.5,27.5 71.47,27.5 | R30.1 77.51,28.99 77,29.5 76.12,29.5 75,30.62 75,33.5 72.5,33.5 71.51,32.51 C65.2 71.5,32.1 71.5,30.81 C66.2 71.21,30 70.5,30 v70,29.5 | v70,27.5 71.47,27.5 | 71.47,27.5 R28.2
N$29
  Bottom 0.152: IC20.3 76,34.5 76,33 77,33 C29.1 77.5,33 79.5,33 R29.2
N$30
  Bottom 0.152: R30.2 79.5,29.02 79.5,30.5 R29.1 80,31 81,31 81,34 80,35 C30.1
N$31  (via drill 0.35)
  Top 0.152: C69.2 93,31.63 93,30.18 C70.2 92.5,29.68 92.5,28.29 R31.2 92.5,27.7 92.5,26.2 C31.2 92.5,25.7 92.5,24.5 | 92.5,24.5 92.5,24 IC21.1 | v95.5,19 95.5,34.39 90.55,34.39 89,32.84 89,29 86.98,29 R33.1 | v93.5,17.5 94,18 94,23 92.5,24.5
  Bottom 0.152: v95.5,19 94,17.5 v93.5,17.5
N$32
  Top 0.152: IC22.3 88.5,34 88,33.5 87.5,33.5 87.5,33.01 C32.1 87,32.5 85.02,32.5 R32.2
N$33
  Top 0.152: R33.2 85,29.05 85,30.52 R32.1 84.48,30.52 83.5,31.5 83.5,33.5 84.5,34.5 C33.1
N$34
  Bottom 0.152: IC23.1 85,24 85,25.68 C34.2 85,26.18 85,27.64 R34.2 85,28.14 85,29.91 C71.2 85,30.12 85,32.13 C72.2 84.56,32.56 85.87,33.87 88.5,33.87 88.5,31 90,29.5 90.5,29.5 90.64,29.36 R36.1
N$35
  Bottom 0.152: IC24.3 89.5,34.5 91,33 C35.1 91.5,33 93,33 R35.2
N$36
  Bottom 0.152: R36.2 93,29.04 93,30.5 R35.1 93.5,31 95,31 95,33.5 93.5,35 C36.1
N$37
  Top 0.152: IC25.1 111.5,24 111.5,25.5 C37.2 111.5,26 111.5,27.5 R37.2 111.5,28 111.5,29.5 C76.2 111.5,30 111.5,31.5 C75.2 111.5,32 111.5,33.5 108.5,33.5 108,33 108,29 106,29 R39.1
N$38
  Top 0.152: IC26.3 107,34 106.5,33.5 106,33.5 106,33 C38.1 105.5,32.5 103.5,32.5 R38.2
N$39
  Top 0.152: R39.2 103.5,29 103.5,30.5 R38.1 103,30.5 102,31.5 102,33.5 103,34.5 C39.1
N$40
  Bottom 0.152: IC27.1 104,24 104,25.68 C40.2 104,26.09 104,27.61 R40.2 104,28.11 104,29.58 C73.2 104,30.08 104,31.65 C74.2 104.5,32.15 104.5,33 105.1,33.6 107.5,33.6 107.5,31 109,29.5 109.5,29.5 110.02,28.98 R42.1
N$41
  Bottom 0.152: IC28.3 108.5,34.5 108.5,33 110,33 C41.1 110.43,33 112.03,33 R41.2
N$42
  Bottom 0.152: R42.2 112,29.06 112,30.49 R41.1 112.48,31 114,31 114,33 112.5,34.5 C42.1
N$43
  Top 0.152: IC29.1 125.5,24 125.5,25.5 C43.2 126,26 126,27.5 R43.2 126,28 126,29.5 C80.2 126,30 126,31.5 C79.2 125.5,32 125.5,33.5 123,33.5 122.5,33 122.5,29 119.98,29 R45.1
N$44
  Top 0.152: IC30.3 121,34 120.5,33.5 120,33.5 120,33.05 C44.1 119.51,33 117.95,33 R44.2
N$45
  Top 0.152: 117.5,30 117.5,29.01 R45.2 | 117.5,30 117.5,30.62 R44.1 | 117.5,30 116,31.5 116,34.5 117,34.5 C45.1
N$46
  Bottom 0.152: IC31.1 117.5,24 117.5,25.5 C46.2 117.5,26 117.5,27.5 R46.2 117.5,28 117.5,29.5 C78.2 117.5,30 117.5,31.5 C77.2 117.5,32 117.5,33 118,33.5 120.5,33.5 120.5,31 122.5,29 123.12,29 R48.1
N$47
  Bottom 0.152: IC32.3 122,34.5 122,33 123.03,33 C47.1 123.46,33 125.07,33 R47.2
N$48
  Bottom 0.152: R48.2 125.5,29.08 125.5,30.54 R47.1 125.49,31 127,31 127,33.77 125.84,34.93 C48.1
N$49  (via drill 0.35)
  Top 0.152: v10.5,20 11.5,21 11.5,24.5 12,25 13,25 v13,25.5
  Bottom 0.152: IC2.4 11.5,20.5 11,20.5 v10.5,20 9.44,18.94 R50.2 | 11.5,25.5 11.5,27 R4.1 11.5,27.5 11.5,29 C51.1 11.5,29.5 11.5,31 C52.1 | 11.5,25.5 v13,25.5 | 11.5,25.5 C4.1
N$50
  Top 0.152: R49.2 17,19 17,19.5 16,20.5 15.5,20.5 IC1.4 15.5,21 14.5,22 14.5,24 15,24.5 15,25 R1.1 15.5,25.5 15.5,27 C1.1 15.5,27.5 15.5,29.5 C50.1 15.5,30 15.5,31.5 C49.1
N$51  (via drill 0.35)
  Top 0.152: IC5.4 29.4,20.6 31,19 R51.2 31.5,19 33,19 v33,25.5 | R7.1 29.5,25.83 29.5,27.29 C7.1 | C53.1 29.5,31.78 29.5,29.78 C54.1 29.5,29.31 29.5,27.82 C7.1 | v27.5,27 28.57,27 C7.1
  Bottom 0.152: v33,25.5 31.5,27 v27.5,27
N$52  (via drill 0.35)
  Top 0.152: v23.77,21.27 25,22.5 25,24.5 25.5,25 26.5,25 v26.5,25.5
  Bottom 0.152: R52.2 22.5,19 23.5,20 24,20 24.5,20.5 IC7.4 24.51,20.53 v23.77,21.27 | 25,25.5 25,27 R10.1 25,27.5 25,29 C56.1 25,29.5 25,31 C55.1 | 25,25.5 25,25 C10.1 25,25.5 | 25,25.5 v26.5,25.5
N$53  (via drill 0.35)
  Top 0.152: IC9.4 47,21 48.5,19.5 48.5,19 R53.2 49,19 50,20 v50,20.5 | 47,26 47,27.5 R13.1 47,28 47,29.5 C57.1 47,30 47,31.5 C58.1 | 47,26 47,25.5 C13.1 47,26 | 47,26 v45.5,26
  Bottom 0.152: v50,20.5 48.5,22 48.5,25.5 47.37,25.5 46.87,26 v45.5,26
N$54  (via drill 0.35)
  Top 0.152: R55.2 62.5,19.5 62.5,20 62,20 61,21 IC13.4 61,21.5 61.5,22 v61.5,22.5 | C63.1 61,32.16 61,30.7 C64.1 61,30.24 61,28.31 R19.1 61,27.85 61,26.3 C19.1 60.63,26 v59.5,26
  Bottom 0.152: v61.5,22.5 61.5,24 58.5,24 58.5,26 v59.5,26
N$55
  Bottom 0.152: 57.5,26.02 57.5,27 R22.1 57.5,27.5 57.5,29.5 C62.1 57.5,30 57.5,31.5 C61.1 | 57.5,26.02 57.5,26 | 57.5,26 57.5,25.52 C22.1 57.5,26.02 | 57.5,26 56.5,26 56,26.5 52,26.5 51,25.5 50,25.5 49.5,25 48.95,25 48.95,23.05 50.5,21.5 53.5,21.5 53.5,19.23 54.39,18.34 R56.2 55.23,18.93 IC15.4
N$56  (via drill 0.35)
  Top 0.152: v41,20.5 42.5,22 42.5,24.5 v45.5,27.5
  Bottom 0.152: IC11.4 44,21 43.63,20.63 42.96,20.63 41.97,19.64 R54.2 41.69,19.21 41,19.9 v41,20.5 | R16.1 44,28 44,29.5 C60.1 44,30 44,31.5 C59.1 | C16.1 44,26 44,27.5 R16.1 | v45.5,27.5 44.5,27.5 R16.1
N$57
  Top 0.152: R58.2 79,19.54 79,20.43 78.57,20.86 77.51,20.86 IC17.4 77.5,21.5 76.79,22.21 76.79,24.79 77,25 77,25.5 C25.1 77.5,26 77.5,27.5 R25.1 77.5,28 77.5,29.5 C68.1 77.5,30 77.5,32 C67.1
N$58
  Top 0.152: IC21.4 91,21 92,21 92,20.5 92.5,20 92.5,19.5 R59.2 92.88,18.96 92.88,17.12 93.5,16.5 94.5,16.5 94.5,32.5 93.5,33.5 91,33.5 91,32.13 C69.1 91,31.63 91,30.18 C70.1 91,29.68 91,28.18 R31.1 91,27.73 91,26.2 C31.1
N$59
  Top 0.152: C75.1 109.5,31.5 109.5,30 C76.1 109.5,29.5 109.5,28 R37.1 109.5,27.5 109.5,26 C37.1 109.5,25.5 108.5,24.5 108.5,22.5 109.5,21.5 | 109.5,21.5 111.5,19.5 R62.2 | 109.5,21.5 IC25.4
N$60
  Bottom 0.152: IC19.4 73.5,21 73,20.5 72.5,20.5 71.5,19.5 R57.2 71,19.5 69,21.5 69,28.5 70,28.5 70.5,29 72.5,29 73,29.5 73.5,29.5 | C28.1 73.5,26.26 73.5,27.5 R28.1 73.5,28.13 73.5,29.5 | C65.1 73.5,32.1 73.5,30.56 C66.1 73.5,30.17 73.5,29.5
N$61
  Top 0.152: R64.2 125.5,19.5 124,21 IC29.4 123.5,21.5 123,22 123,24.5 123.5,25 123.5,25.5 C43.1 124,26 124,27.5 R43.1 124,28 124,29.5 C80.1 124,30 124,31.5 C79.1
N$62  (via drill 0.35)
  Top 0.152: v86,21 86.03,21.03 86.03,24.03 87.5,25.5 88.54,25.5 v88.54,26.33
  Bottom 0.152: IC23.4 87,21 v86,21 85.5,20.5 85.5,19.5 R60.2 | 87,26.33 87,27.64 R34.1 87,28.14 87,29.69 C71.1 87,30.14 87,32.11 C72.1 | 87,26.33 87,26.18 C34.1 | 87,26.33 v88.54,26.33
N$64
  Bottom 0.152: IC27.4 106,21 105.5,20.5 105.19,20.5 104.04,19.35 R61.2 104.5,19 104.5,16.5 112,16.5 114,18.5 114,20.5 112.5,20.5 112.2,20.8 112.2,23.3 110,25.5 109.5,25.5 107.5,27.5 106.01,27.5 | C40.1 106,26.28 106,27.5 106.01,27.5 | C74.1 106,31.65 106,30.08 C73.1 106,29.58 106,28.11 R40.1 106.01,27.5
N$66  (via drill 0.35)
  Top 0.152: v119,22.5 119.68,23.18 119.68,24.95 120.23,25.5 121,25.5 v121,26
  Bottom 0.152: R63.2 117.25,19.39 119.09,21.23 IC31.4 119,21.5 v119,22.5 | 119.5,26 119.5,27.5 R46.1 119.5,28 119.5,29.5 C78.1 119.5,30 119.5,31.5 C77.1 | 119.5,26 v121,26 | 119.5,26 C46.1
REF_S1  (via drill 0.35)
  Top 0.152: v16.5,21 15.5,22 15.5,23 IC1.3 | 13,18.5 v14,17.5 14,6.5 J1.2 | 13,18.5 14.5,20 14.5,21 13.5,22 U1.6 | 13,18.5 C82.1
  Bottom 0.152: v16.5,21 13,21 12.5,20.5 12.5,18.5 13,18.5 v14,17.5
REF_S2
  Bottom 0.152: 8.68,15.82 15.32,15.82 18,18.5 C84.1 17.5,19 17.5,21 16.5,22 15,22 14.5,21.5 U2.6 | IC2.3 11.5,23 11.5,21.75 8.78,21.75 8,20.97 8,16 8.5,16 8.68,15.82 | 8.68,15.82 J1.4
REF_S3
  Top 0.152: IC5.3 29.49,22.99 28,21.5 27,21.5 U3.6 26.5,21.5 25.5,21.5 25,21 25,20 25.5,19.5 25.5,19 C86.1 25.5,18.5 25.5,6 J1.6
REF_S4
  Bottom 0.152: IC7.3 24.5,23 26,21.5 27,21.5 U4.6 27.5,21.5 29,21.5 29,18.9 C88.1 29,18.37 29,9.5 J1.8
REF_S5
  Top 0.152: 46,22.5 45.5,22 44.5,22 U5.6 | 46,22.5 47,23.5 IC9.3 | 46,22.5 46,21 45.5,20.5 45.5,19 43.5,19 C90.1 43.5,18.5 J2.2
REF_S6
  Bottom 0.152: IC11.3 44,23.5 45,22.5 46.5,22.5 U6.6 47,22 48,22 48.5,21.5 48.5,19.5 C92.1 48,19 48,7.5 J2.4
REF_S7
  Top 0.152: IC13.3 60.5,23.5 59.5,22.5 58.5,22.5 U7.6 58,22.5 57.5,22.5 56.5,21.5 56.5,20 57,19.5 C94.1 57.5,19 J2.6
REF_S8
  Bottom 0.152: IC15.3 57.02,22.98 58,22 59.5,22 U8.6 60,22 61,22 61.5,21.5 61.5,19 C96.1 61.5,18.5 61.5,8 J2.8
REF_S9  (via drill 0.35)
  Top 0.152: v78.5,21.5 77.5,22.5 77.5,23.5 IC17.3 | v76,19.5 73.5,19.5 C98.1 | U9.6 74.5,22.5 73,22.5 73,19.5 C98.1 | J3.2 73.5,6 73.5,19 C98.1
  Bottom 0.152: v78.5,21.5 77.5,20.5 77,20.5 v76,19.5
REF_S10
  Bottom 0.152: IC19.3 73.5,23.5 74.5,22.5 76,22.5 U10.6 76.5,22.5 79.5,22.5 79.5,21.5 78.5,20.5 78,20.5 78,19.5 C100.1 78,19 78,8.5 J3.4
REF_S11
  Top 0.152: IC21.3 90.5,23.5 89,22 88.5,22 U11.6 88,22 87.5,22 87.09,21.59 87.09,20.13 C102.1 87,19 87,6.5 J3.6
REF_S12  (via drill 0.35)
  Top 0.152: J3.8 92,8.5 v92,17
  Bottom 0.152: IC23.3 87,23.5 88,22.5 89.5,22.5 U12.6 90,22.5 90.5,22.5 90.5,22 91.5,21 91.5,19.5 C104.1 91,19 91,18 v92,17
REF_S13  (via drill 0.35)
  Top 0.152: v110.5,21.5 110.5,22 110,22.5 110,23 109.5,23.5 IC25.3 | v107.6,20.09 106.01,18.5 105.5,18.5 | 105.5,18.5 105.5,19 C106.1 | U13.6 107,22 105.5,22 105.5,19.5 C106.1 | 105.5,18.5 J4.2 | 105.5,18.5 C106.1
  Bottom 0.152: v110.5,21.5 110.5,21 110,20.5 108.01,20.5 v107.6,20.09
REF_S14  (via drill 0.35)
  Top 0.152: J4.4 110.99,6.51 110.99,17.55 v111.01,17.58
  Bottom 0.152: IC27.3 106,23.5 107,22.5 108.5,22.5 U14.6 109,22.5 111.23,22.5 111.23,21.23 110.5,20.5 110.5,19.5 C108.1 110.5,19 110.5,18.15 111.01,17.64 v111.01,17.58
REF_S15  (via drill 0.35)
  Top 0.152: v124,22.5 124,23.5 IC29.3 | v121,20 120,19 C110.1 | U15.6 121,22 119.5,22 119.5,19.5 C110.1 | J4.6 119.5,19 C110.1
  Bottom 0.152: v124,22.5 124,21 123.5,20.5 121.5,20.5 v121,20
REF_S16
  Bottom 0.152: IC31.3 119,23.5 120,22.5 121.5,22.5 U16.6 122,22.5 123.14,22.5 123.91,23.27 124.76,23.27 124.76,21.26 123.5,20 123.5,19.5 C112.1 123.5,19 123.5,8 J4.8
S1
  Top 0.152: J1.1 9,4.5 10,3.5 16.5,3.5 17.5,4.5 17.5,15 16,16.5 16,18 15.5,18.5 R49.1
S2  (via drill 0.35)
  Top 0.152: v15,17 16,16 J1.3
  Bottom 0.152: v15,17 14.69,16.69 11.5,16.69 11.5,18.12 R50.1
S3
  Top 0.152: J1.5 23,4.5 24,3.5 27,3.5 28,4.5 28,17.5 29,18.5 R51.1
S4
  Bottom 0.152: J1.7 27.31,7.69 27.31,16.19 25,18.5 R52.1
S5
  Top 0.152: J2.1 40,4.5 41,3.5 44,3.5 45,4.5 45,18.5 46.5,18.5 R53.1
S6
  Bottom 0.152: J2.3 45.5,6.5 44,6.5 44,19 R54.1
S7
  Top 0.152: J2.5 54,4.5 55,3.5 58,3.5 59,4.5 59,17.5 60.5,19 R55.1
S8
  Bottom 0.152: J2.7 59.5,6.5 57.5,6.5 57.5,17.85 R56.1
S9
  Top 0.152: J3.1 71,4.5 72,3.5 75,3.5 76,4.5 76,17.5 77.6,19.1 R58.1
S10
  Bottom 0.152: J3.3 77,6 77,15.5 73.5,19 R57.1
S11
  Top 0.152: J3.5 85,4.5 86,3.5 89.15,3.5 89.93,4.28 89.93,18.57 90.29,18.93 R59.1
S12  (via drill 0.35)
  Top 0.152: v90.67,16.61 91.1,16.18 91.1,5.9 J3.7
  Bottom 0.152: v90.67,16.61 87,16.61 87,19 R60.1
S13
  Top 0.152: J4.1 102,4.5 103,3.5 106,3.5 107,4.5 107,19 109.5,19 R62.1
S14  (via drill 0.35)
  Top 0.152: v108.11,17.59 109,16.7 J4.3
  Bottom 0.152: v108.11,17.59 107.41,17.59 106,19 R61.1
S15
  Top 0.152: J4.5 116,4.5 117,3.5 120.06,3.5 120.97,4.41 120.97,16.48 123.5,19 R64.1
S16
  Bottom 0.152: J4.7 121.5,6.5 119.5,6.5 119.5,19 R63.1

## Text on the board
tPlace: Tarjeta de Amplificadores de Carga | ver 1.0 | SP1+ | SP1- | SP2+ | SP2- | SP3+ | SP3- | SP4+ | SP4- | SP5+ | SP5- | SP6+ | SP6- | SP7+ | SP7- | SP8+ | SP8- | SP9+ | SP9- | SP10+ | SP10- | SP11+ | SP11- | SP12+ | SP12- | SP13+ | SP13- | SP14+ | SP14- | SP15+ | SP15- | SP16+ | SP16-